# Altium schematic sheet TIDA-01576_ADS8686S_ISO_Interface_Pg7-Connectors.SchDoc
size 431 x 279 mm; Date: Not shown in title block; ApprovedBy: Not shown in title block; CheckedBy: Not shown in title block; Author: Not shown in title block; CompanyName: Not shown in title block; Engineer: Not shown in title block; Organization: Not shown in title block; Address1: Not shown in title block; Address2: Not shown in title block; Address3: Not shown in title block; Address4: Not shown in title block; DocumentNumber: 1; Revision: Use project parameter SCH_Rev; SheetNumber: 7; SheetTotal: 8; PageSetup: Record=PageOptions|CenterHorizontal=True|CenterVertical=True|PrintScale=1.00|XCorrection=1.00|YCorrection=1.00|PrintKind=0|BorderSize=5000000|LeftOffset=0|BottomOffset=0|Orientation=2|PaperLength=1000|PaperWidth=1000|Scale=100|PaperSource=15|PrintQuality=600|MediaType=1|DitherType=10|PaperKind=Letter|PrintScaleMode=1; CurrentTime: Not shown in title block; CurrentDate: Not shown in title block; Time: Not shown in title block; DocumentFullPathAndName: Not shown in title block; DocumentName: Not shown in title block; ModifiedDate: Not shown in title block; ImagePath: Not shown in title block
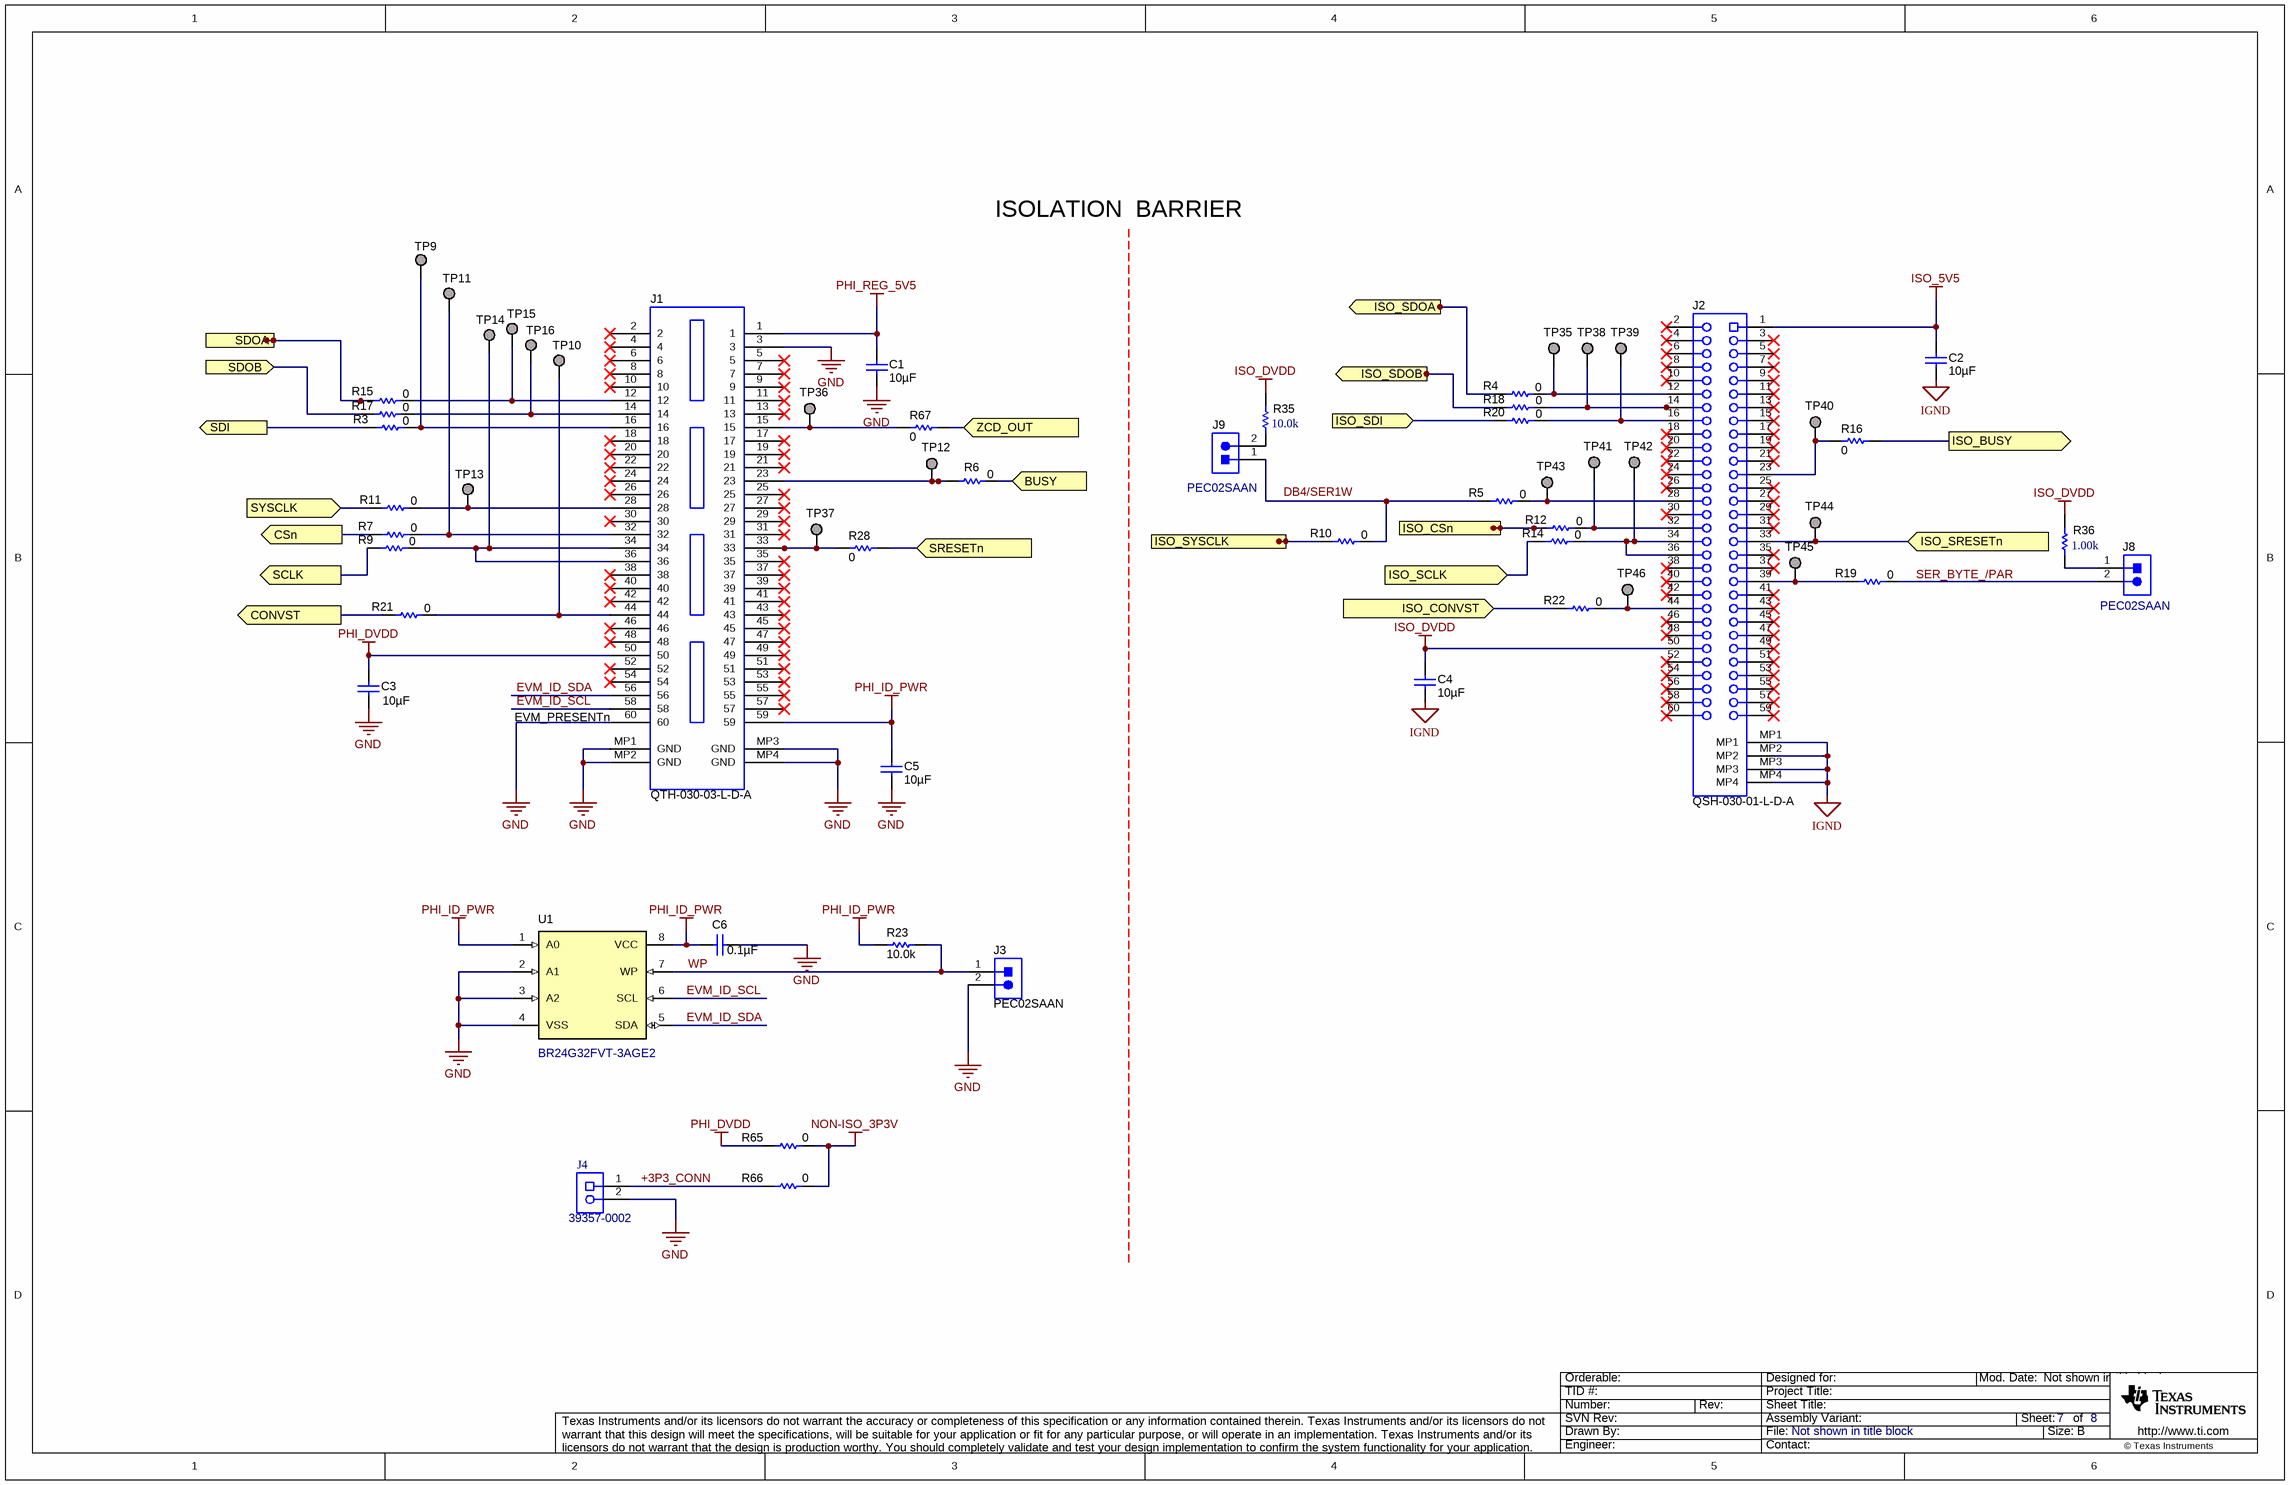
[diagram p0: TIDA-01576_ADS8686S_ISO_Interface_Pg7-Connectors.SchDoc]

## Parts
C1  ValueDisplayed: 10µF  [0805_HV]  (hidden comment: GRM21BR71A106KE51L)
C2  ValueDisplayed: 10µF  [0805_HV]  (hidden comment: GRM21BR71A106KE51L)
C3  ValueDisplayed: 10µF  [0805_HV]  (hidden comment: GRM21BR71A106KE51L)
C4  ValueDisplayed: 10µF  [0805_HV]  (hidden comment: GRM21BR71A106KE51L)
C5  ValueDisplayed: 10µF  [0805_HV]  (hidden comment: GRM21BR71A106KE51L)
C6  ValueDisplayed: 0.1µF  [0402]  (hidden comment: GRM155R71C104KA88D)
J1  QTH-030-03-L-D-A  [Samtec_QTH-030-01-x-D-A]
J2  QSH-030-01-L-D-A  [Samtec_QSH-030-01-X-D-A]
J3  PEC02SAAN  [CONN_PEC02SAAN]
J4  39357-0002  [MOLEX_39357-0002]
J8  PEC02SAAN  [CONN_PEC02SAAN]
J9  PEC02SAAN  [CONN_PEC02SAAN]
R3  ValueDisplayed: 0  [0402]  (hidden comment: ERJ-2GE0R00X)
R4  ValueDisplayed: 0  [0402]  (hidden comment: ERJ-2GE0R00X)
R5  ValueDisplayed: 0  [0402]  (hidden comment: ERJ-2GE0R00X)
R6  ValueDisplayed: 0  [0402]  (hidden comment: ERJ-2GE0R00X)
R7  ValueDisplayed: 0  [0402]  (hidden comment: ERJ-2GE0R00X)
R9  ValueDisplayed: 0  [0402]  (hidden comment: ERJ-2GE0R00X)
R10  ValueDisplayed: 0  [0402]  (hidden comment: ERJ-2GE0R00X)
R11  ValueDisplayed: 0  [0402]  (hidden comment: ERJ-2GE0R00X)
R12  ValueDisplayed: 0  [0402]  (hidden comment: ERJ-2GE0R00X)
R14  ValueDisplayed: 0  [0402]  (hidden comment: ERJ-2GE0R00X)
R15  ValueDisplayed: 0  [0402]  (hidden comment: ERJ-2GE0R00X)
R16  ValueDisplayed: 0  [0402]  (hidden comment: ERJ-2GE0R00X)
R17  ValueDisplayed: 0  [0402]  (hidden comment: ERJ-2GE0R00X)
R18  ValueDisplayed: 0  [0402]  (hidden comment: ERJ-2GE0R00X)
R19  ValueDisplayed: 0  [0402]  (hidden comment: ERJ-2GE0R00X)
R20  ValueDisplayed: 0  [0402]  (hidden comment: ERJ-2GE0R00X)
R21  ValueDisplayed: 0  [0402]  (hidden comment: ERJ-2GE0R00X)
R22  ValueDisplayed: 0  [0402]  (hidden comment: ERJ-2GE0R00X)
R23  ValueDisplayed: 10.0k  [0603]  (hidden comment: CRCW060310K0FKEA)
R28  ValueDisplayed: 0  [0402]  (hidden comment: ERJ-2GE0R00X)
R35  ValueDisplayed: 10.0k  [0402]  (hidden comment: ERJ-2RKF1002X)
R36  ValueDisplayed: 1.00k  [0402]  (hidden comment: ERJ-2RKF1001X)
R65  ValueDisplayed: 0  [0603]  (hidden comment: CRCW06030000Z0EA)
R66  ValueDisplayed: 0  [0603]  (hidden comment: CRCW06030000Z0EA)
R67  ValueDisplayed: 0  [0402]  (hidden comment: ERJ-2GE0R00X)
TP9  TP_H0.45P0.75  [TP_H045P075]  (value not drawn)
TP10  TP_H0.45P0.75  [TP_H045P075]  (value not drawn)
TP11  TP_H0.45P0.75  [TP_H045P075]  (value not drawn)
TP12  TP_H0.45P0.75  [TP_H045P075]  (value not drawn)
TP13  TP_H0.45P0.75  [TP_H045P075]  (value not drawn)
TP14  TP_H0.45P0.75  [TP_H045P075]  (value not drawn)
TP15  TP_H0.45P0.75  [TP_H045P075]  (value not drawn)
TP16  TP_H0.45P0.75  [TP_H045P075]  (value not drawn)
TP35  TP_H0.45P0.75  [TP_H045P075]  (value not drawn)
TP36  TP_H0.45P0.75  [TP_H045P075]  (value not drawn)
TP37  TP_H0.45P0.75  [TP_H045P075]  (value not drawn)
TP38  TP_H0.45P0.75  [TP_H045P075]  (value not drawn)
TP39  TP_H0.45P0.75  [TP_H045P075]  (value not drawn)
TP40  TP_H0.45P0.75  [TP_H045P075]  (value not drawn)
TP41  TP_H0.45P0.75  [TP_H045P075]  (value not drawn)
TP42  TP_H0.45P0.75  [TP_H045P075]  (value not drawn)
TP43  TP_H0.45P0.75  [TP_H045P075]  (value not drawn)
TP44  TP_H0.45P0.75  [TP_H045P075]  (value not drawn)
TP45  TP_H0.45P0.75  [TP_H045P075]  (value not drawn)
TP46  TP_H0.45P0.75  [TP_H045P075]  (value not drawn)
U1  BR24G32FVT-3AGE2  [TSOP65P640X120-8N]

## Ports
BUSY (in), CONVST (out), CSn (out), ISO_BUSY (out), ISO_CONVST (in), ISO_CSn (in), ISO_SCLK (in), ISO_SDI (in), ISO_SDOA (out), ISO_SDOB (out), ISO_SRESETn (in), ISO_SYSCLK (out), SCLK (out), SDI (out), SDOA (in), SDOB (in), SRESETn (in), SYSCLK (in), ZCD_OUT (in)

## Nets
GND: C1.2 C3.2 C5.2 C6.1 J1.3 J1.60 J1.MP1(GND) J1.MP2(GND) J1.MP3(GND) J1.MP4(GND) J3.2 J4.2 U1.2(A1) U1.3(A2) U1.4(VSS)
IGND: C2.2 C4.2 J2.MP1 J2.MP2 J2.MP3 J2.MP4
ISO_5V5: C2.1 J2.1
ISO_DVDD: C4.1 J2.50 R35.2 R36.2
NON-ISO_3P3V: R65.1 R66.1
PHI_DVDD: C3.1 J1.50 R65.2
PHI_ID_PWR: C5.1 C6.2 J1.59 R23.2 U1.1(A0) U1.8(VCC)
PHI_REG_5V5: C1.1 J1.1
+3P3_CONN: J4.1 R66.2
BUSY: R6.2 ; port BUSY
CONVST: R21.1 ; port CONVST
CSn: R7.1 ; port CSn
EVM_ID_SCL: J1.58 U1.6(SCL)
EVM_ID_SDA: J1.56 U1.5(SDA)
ISO_BUSY: R16.1 ; port ISO_BUSY
ISO_CONVST: R22.1 ; port ISO_CONVST
ISO_CSn: R12.1 ; port ISO_CSn
ISO_SCLK: R14.1 ; port ISO_SCLK
ISO_SDI: R20.1 ; port ISO_SDI
ISO_SDOA: R4.1 ; port ISO_SDOA
ISO_SDOB: R18.1 ; port ISO_SDOB
ISO_SRESETn: J2.33 TP44.1 ; port ISO_SRESETn
ISO_SYSCLK: R10.1 ; port ISO_SYSCLK
SCLK: R9.1 ; port SCLK
SDI: R3.1 ; port SDI
SDOA: R15.1 ; port SDOA
SDOB: R17.1 ; port SDOB
SRESETn: R28.1 ; port SRESETn
SYSCLK: R11.1 ; port SYSCLK
WP: J3.1 R23.1 U1.7(WP)
ZCD_OUT: R67.1 ; port ZCD_OUT
NetJ1_12: J1.12 R15.2 TP15.1
NetJ1_14: J1.14 R17.2 TP16.1
NetJ1_15: J1.15 R67.2 TP36.1
NetJ1_16: J1.16 R3.2 TP9.1
NetJ1_23: J1.23 R6.1 TP12.1
NetJ1_28: J1.28 R11.2 TP13.1
NetJ1_32: J1.32 R7.2 TP11.1
NetJ1_33: J1.33 R28.2 TP37.1
NetJ1_34: J1.34 J1.36 R9.2 TP14.1
NetJ1_44: J1.44 R21.2 TP10.1
NetJ2_12: J2.12 R4.2 TP35.1
NetJ2_14: J2.14 R18.2 TP38.1
NetJ2_16: J2.16 R20.2 TP39.1
NetJ2_23: J2.23 R16.2 TP40.1
NetJ2_28: J2.28 R5.2 TP43.1
NetJ2_32: J2.32 R12.2 TP41.1
NetJ2_34: J2.34 J2.36 R14.2 TP42.1
NetJ2_39: J2.39 R19.1 TP45.1
NetJ2_44: J2.44 R22.2 TP46.1
NetJ8_1: J8.1 R36.1
NetJ8_2: J8.2 R19.2
NetJ9_1: J9.1 R5.1 R10.2
NetJ9_2: J9.2 R35.1

Not connected (* = marked no-connect by the designer): J1 2* 4* 5* 6* 7* 8* 9* 10* 11* 13* 17* 18* 19* 20* 21* 22* 24* 25* 26* 27* 29* 30* 31* 35* 37* 38* 39* 40* 41* 42* 43* 45* 46* 47* 48* 49* 51* 52* 53* 54* 55* 57*; J2 2* 3* 4* 5* 6* 7* 8* 9* 10* 11* 13* 15* 17* 18* 19* 20* 21* 22* 24* 25* 26* 27* 29* 30* 31* 35* 37* 38* 40* 41* 42* 43* 45* 46* 47* 48* 49* 51* 52* 53* 54* 55* 56* 57* 58* 59* 60*

## Notes on the sheet
- ISOLATION  BARRIER
- SDOA/B SEL
- (near J8) SERIAL SEL
- (near J1) EVM_PRESENTn
- Labels drawn without touching a wire or pin: DB4/SER1W, SER_BYTE_/PAR
- Drawn By:
- SVN Rev:
- Number:
- TID #:
- Orderable:
- Rev:
- Sheet Title:
- File:
- Project Title:
- Designed for:
- Assembly Variant:
- Mod. Date:
- Sheet:
- Size:
- of
- B
- http://www.ti.com
- Texas Instruments and/or its licensors do not warrant the accuracy or completeness of this specification or any information contained therein. Texas Instruments and/or its licensors do not warrant that this design will meet the specifications, will be suitable for your application or fit for any particular purpose, or will operate in an implementation. Texas Instruments and/or its licensors do not warrant that the design is production worthy. You should completely validate and test your design implementation to confirm the system functionality for your application.
- Engineer:
- Contact:
- © Texas Instruments

## Library data of the parts
C1-C5 = GRM21BR71A106KE51L: CAP, CERM, 10 µF, 10 V, +/- 10%, X7R, 0805; Manufacturer: MuRata; Polarized: N; CompType: Capacitor; Value: 10uF; U/M: EA; Cap_F: 0.00001; Tolerance_%: 10; ESR_ohm: 0.003; Value1: 0.003 ohm; Value2: 10V; TaMin_C: -55; TaMax_C: 125; Cap_Case: 0805; AEC Category: Q200; SymbolVersion: 2008-07-09; PartNumber: GRM21BR71A106KE51L; PackageReference: 0805; RoHS: Y; VDC_V: 10; MountType: SMT; Technology: Ceramic; TempCo: X7R; Published: 2008-06-19; Publisher: Texas Instruments; LatestRevisionDate: 2015-11-13; ComponentLink1Description: Datasheet link; ComponentLink1URL: http://search.murata.co.jp/Ceramy/PnsearchViewAction.do?HnOFG=ON&HnNFG=ON&SEL_CNT=50&sLang=en&sKey=GRM21BR71A106KE51L&x=9&y=9&search=startwith; Supplier 1: Digi-Key; Supplier Part Number 1: 490-3905-1-ND; Supplier 2: Mouser; Supplier Part Number 2: 81-GRM21BR71A106KE51; Supplier 3: Farnell; Supplier Part Number 3: 1828828; AEC Qualified: ?
C6 = GRM155R71C104KA88D: CAP, CERM, 0.1 µF, 16 V, +/- 10%, X7R, 0402; Manufacturer: MuRata; Polarized: N; CompType: Capacitor; Value: 0.1uF; U/M: EA; Cap_F: 0.0000001; Tolerance_%: 10; Value1: Unknown; VDC_V: 16; Value2: 16V; TaMin_C: -55; TaMax_C: 125; SymbolVersion: 2008-07-09; PartNumber: GRM155R71C104KA88D; PackageReference: 0402; RoHS: Y; MountType: SMT; Technology: Ceramic; TempCo: X7R; Cap_Case: 0402; Published: 2008-06-19; Publisher: Texas Instruments; LatestRevisionDate: 2015-07-09; ComponentLink1Description: Datasheet link; ComponentLink1URL: http://search.murata.co.jp/Ceramy/PnsearchViewAction.do?HnOFG=ON&HnNFG=ON&SEL_CNT=50&sLang=en&sKey=GRM155R71C104KA88D&x=9&y=9&search=startwith; Supplier 1: Digi-Key; Supplier Part Number 1: 490-3261-1-ND; Supplier 2: Mouser; Supplier Part Number 2: 81-GRM155R71C104KA88; Supplier 3: Farnell; Supplier Part Number 3: 8819742
J1 = QTH-030-01-L-D-A: Header(Shrouded), 19.7mil, 30x2, Gold, SMT; Manufacturer: Samtec; SymbolCreator: Altium; U/M: EA; SymbolVersion: 2015-05-13; PartNumber: QTH-030-03-L-D-A; PackageReference: Header (Shrouded), 19.7mil, 30x2, SMT; CompType: Header; RoHS: Y; MountType: SMT; ComponentLink1Description: Datasheet Link; ComponentLink1URL: https://www.samtec.com/ftppub/cpdf/QTH-XXX-XX-X-D-XXX-MKT.pdf; Publisher: Texas Instruments; LatestRevisionDate: 2015-07-08; Supplier 1: Digi-Key; Supplier Part Number 1: SAM8185-ND
J2 = QSH-030-01-L-D-A: Receptacle, 0.5 mm, 30x2, Gold, TH; Manufacturer: Samtec; SymbolCreator: Altium; Pitch_mm: 0.5; Gender: Female; Shrouded: N; Row_Count: 2; RowSpacing_mm: 5.73; SymbolVersion: 2015-03-06; PartNumber: QSH-030-01-L-D-A; PackageReference: Receptacle, 0.5 mm, 30x2, TH; CompType: Receptacle; RoHS: Y; MountType: SMT; ComponentLink1Description: Datasheet URL; ComponentLink1URL: http://www.samtec.com/ftppub/cpdf/QSH-XXX-01-X-D-XX-MKT.pdf; Orientation: Vertical; PinCount: 60; ContactFinish: Gold; Color: Black; Publisher: Texas Instruments; LatestRevisionDate: 2017-04-12; Supplier 1: Digi-Key; Supplier Part Number 1: SAM8180-ND; Supplier 2: Newark; Supplier Part Number 2: 19M9181; Supplier 3: Farnell; Supplier Part Number 3: 1667876
J3 = PEC02SAAN: Header, 100mil, 2x1, Tin, TH; Manufacturer: Sullins Connector Solutions; SymbolCreator: a0412235; Pitch_mm: 2.54; Gender: Male; Shrouded: N; Row_Count: 1; Current_A: 3; Voltage_V: 1800; Cert_UL: Y; Green_Lifecycle: Not Set; Green_REACh: Incomplete; SymbolVersion: 2013-10-31; PartNumber: PEC02SAAN; PackageReference: Header, 2 PIN, 100mil, Tin; ClassName: Header; CompType: Header; RoHS: Y; MountType: TH; ComponentLink1Description: Datasheet URL; ComponentLink1URL: http://www.sullinscorp.com/catalogs/77_PAGE108-109_.100_MALE_HDR.pdf; Orientation: Vertical; PinCount: 2; ContactFinish: Tin; Color: Black; Publisher: Texas Instruments; LatestRevisionDate: 2017-05-15; Supplier 1: Digi-Key; Supplier Part Number 1: S1012E-02-ND; Green_EU RoHS: Incomplete; Green_EU RoHS-2: Incomplete
J4 = CMP-0055341-1: Terminal Block, 3.5 mm, 2x1, Tin, TH; Manufacturer: Molex; CNHeader: FALSE; Green_Lifecycle: Not Set; Green_REACh: Incomplete; CT: TRUE; ComponentLink1URL: http://www.molex.com/pdm_docs/sd/393570002_sd.pdf; Supplier Part Number 2: 72K2104; Publisher: Texas Instruments; Supplier 2: Newark; Supplier Part Number 3: 538-39357-0002; Supplier 3: Mouser; RoHS: Y; MountType: TH; Green_EU RoHS-2: Incomplete; Supplier 1: Digi-Key; Green_EU RoHS: Incomplete; PackageReference: Terminal Block, 3.5 mm, 2x1, TH; CompType: Terminal Block; LatestRevisionDate: 26/05/2017; PartNumber: 39357-0002; ComponentLink1Description: Datasheet URL; Supplier Part Number 1: WM7877-ND
J8 J9 = CMP-0002337-1: Header, 100mil, 2x1, Tin, TH; Manufacturer: Sullins Connector Solutions; CNHeader: TRUE; Current_A: 3A; Green_Lifecycle: Not Set; Shrouded: N; Gender: Male; Green_REACh: Incomplete; Voltage_V: 1.8kV; Row_Count: 1; Pitch_mm: 2.54; CT: FALSE; Cert_UL: Y; ComponentLink1URL: http://www.sullinscorp.com/catalogs/77_PAGE108-109_.100_MALE_HDR.pdf; ClassName: Header; Publisher: Texas Instruments; Color: Black; RoHS: Y; MountType: TH; Green_EU RoHS-2: Incomplete; Supplier 1: Digi-Key; Green_EU RoHS: Incomplete; PackageReference: Header, 2 PIN, 100mil, Tin; PinCount: 2; CompType: Header; LatestRevisionDate: 26/05/2017; PartNumber: PEC02SAAN; Orientation: Vertical; ComponentLink1Description: Datasheet URL; Supplier Part Number 1: S1012E-02-ND; ContactFinish: Tin
R3-R7 R9-R12 R14-R22 R28 R67 = ERJ-2GE0R00X: RES, 0, 5%, 0.063 W, 0402; Manufacturer: Panasonic; CompType: Resistor; Value: 0; Value_Code: 0000; Tolerance_%: 5; Power_W: 0.063; Value2: 0.063W; VDC_V: 50; TempCo: 600 ppm/C; EIA_Code: E24; U/M: EA; AEC Category: Q200; SymbolVersion: 2009-05-29; PartNumber: ERJ-2GE0R00X; PackageReference: 0402; RoHS: Y; Res_ohm: 0; Value1: 5%; MountType: SMT; Technology: Thick Film; Published: 2008-06-26; Publisher: Texas Instruments; LatestRevisionDate: 2015-10-23; ComponentLink1Description: Datasheet link; ComponentLink1URL: http://www.panasonic.com/industrial/components/pdf/AOA0000CE1.pdf; Supplier 1: Digi-Key; Supplier Part Number 1: P0.0JCT-ND; Supplier 2: Mouser; Supplier Part Number 2: 667-ERJ-2GE0R00X; Supplier 3: Farnell; Supplier Part Number 3: 2059190; AEC Qualified: ?
R23 = CRCW060310K0FKEA: RES, 10.0 k, 1%, 0.1 W, 0603; Manufacturer: Vishay-Dale; CompType: Resistor; Value: 10.0k; Res_ohm: 10000; Value_Code: 10k0; Tolerance_%: 1; Power_W: 0.1; Value2: 0.1W; VDC_V: 75; TempCo: 100 ppm/C; EIA_Code: E96; U/M: EA; SymbolVersion: 2009-05-29; PartNumber: CRCW060310K0FKEA; PackageReference: 0603; RoHS: Y; Value1: 1%; MountType: SMT; Technology: Thick Film; Published: 2008-06-26; Publisher: Texas Instruments; LatestRevisionDate: 2015-06-13; ComponentLink1Description: Datasheet link; ComponentLink1URL: http://www.vishay.com/docs/20035/dcrcwe3.pdf; Supplier 1: Digi-Key; Supplier Part Number 1: 541-10.0KHCT-ND; Supplier 2: Mouser; Supplier Part Number 2: 71-CRCW0603-10K-E3; Supplier 3: Farnell; Supplier Part Number 3: 1469748
R35 = CMP-0026658-1: RES, 10.0 k, 1%, 0.1 W, 0402; Manufacturer: Panasonic; Power_W: 100mW; TempCo: 100 ppm/C; Value_Code: 10k0; U/M: EA; Value: 10.0k; EIA_Code: E96; Res_ohm: 10k; SizeX_mm: 1; SizeY_mm: 0.5; SizeZ_mm: 0.6; Value2: 0.1W; VDC_V: 50V; AEC Category: Q200; ComponentLink1URL: http://industrial.panasonic.com/www-data/pdf/AOA0000/AOA0000CE2.pdf; Supplier Part Number 2: 90W2949; Publisher: Texas Instruments; Supplier 2: Newark; Supplier Part Number 3: 667-ERJ-2RKF1002X; Supplier 3: Mouser; Published: 2008-06-26; RoHS: Y; Value1: 1%; MountType: SMT; Supplier 1: Digi-Key; PackageReference: 0402; Tolerance_%: 1%; SizeArea_mm2: 0.5; CompType: Resistor; LatestRevisionDate: 2017-03-09; PartNumber: ERJ-2RKF1002X; AEC Qualified: ?; ComponentLink1Description: Datasheet link; Supplier Part Number 1: P10.0KLCT-ND; Technology: Thick Film
R36 = CMP-0026657-1: RES, 1.00 k, 1%, 0.1 W, 0402; Manufacturer: Panasonic; Power_W: 100mW; TempCo: 100 ppm/C; Value_Code: 1k00; U/M: EA; Value: 1.00k; EIA_Code: E96; Res_ohm: 1k; SizeX_mm: 1; SizeY_mm: 0.5; SizeZ_mm: 0.6; Value2: 0.1W; VDC_V: 50V; AEC Category: Q200; ComponentLink1URL: http://industrial.panasonic.com/www-data/pdf/AOA0000/AOA0000CE2.pdf; Supplier Part Number 2: 64R5247; Publisher: Texas Instruments; Supplier 2: Newark; Supplier Part Number 3: 667-ERJ-2RKF1001X; Supplier 3: Mouser; Published: 2008-06-26; RoHS: Y; Value1: 1%; MountType: SMT; Supplier 1: Digi-Key; PackageReference: 0402; Tolerance_%: 1%; SizeArea_mm2: 0.5; CompType: Resistor; LatestRevisionDate: 2017-03-09; PartNumber: ERJ-2RKF1001X; AEC Qualified: ?; ComponentLink1Description: Datasheet link; Supplier Part Number 1: P1.00KLCT-ND; Technology: Thick Film
R65 R66 = CRCW06030000Z0EA: RES, 0, 5%, 0.1 W, 0603; Manufacturer: Vishay-Dale; CompType: Resistor; Value: 0; Value_Code: 0000; Tolerance_%: 5; Power_W: 0.1; Value2: 0.1W; VDC_V: 75; TempCo: 200 ppm/C; EIA_Code: E24; U/M: EA; SymbolVersion: 2009-05-29; PartNumber: CRCW06030000Z0EA; PackageReference: 0603; RoHS: Y; Res_ohm: 0; Value1: 5%; MountType: SMT; Technology: Thick Film; Published: 2008-06-26; Publisher: Texas Instruments; LatestRevisionDate: 2014-10-21; ComponentLink1Description: Datasheet link; ComponentLink1URL: http://www.vishay.com/docs/20035/dcrcwe3.pdf; Supplier 1: Digi-Key; Supplier Part Number 1: 541-0.0GCT-ND; Supplier 2: Mouser; Supplier Part Number 2: 71-CRCW0603-0-E3; Supplier 3: Farnell; Supplier Part Number 3: 1469739
TP9-TP16 TP35-TP46 = TP_H0.45P0.75: Testpoint; Manufacturer: Texas Instruments; SymbolCreator: a0412235; CompType: Pad; SymbolVersion: 2017-04-26; PartNumber: TP_H0.45P0.75; PackageReference: Test Point, 0.45mm hole size; MountType: TH; ComponentLink1Description: Datasheet Link; ComponentLink1URL: https://sps06.itg.ti.com/sites/KMS/crossdivteams/altium/docs/ComponentDatasheets/testpin with 750um Padsice and 450um drillhole.pdf; Publisher: Texas Instruments; LatestRevisionDate: 2017-05-23
U1 = CMP-0004843-1: I2C BUS EEPROM (2-Wire), TSSOP-B8; Manufacturer: Rohm; ComponentLink1URL: http://rohmfs.rohm.com/en/products/databook/datasheet/ic/memory/eeprom/br24g32-3-e.pdf; Publisher: Texas Instruments; Supplier Part Number 2: 755-BR24G32FVT-3AGE2; Supplier 1: Digi-Key; PackageReference: TSSOP-8; LatestRevisionDate: 09/03/2017; RoHS: Y; Supplier Part Number 1: BR24G32FVT-3AG2CT-ND; MountType: SMT; Supplier 2: Mouser; PartNumber: BR24G32FVT-3AGE2; ComponentLink1Description: Datasheet URL